# Altium schematic sheet Sheet2.SchDoc
size A4; SheetNumber: 1; SheetTotal: 2; Time: DD
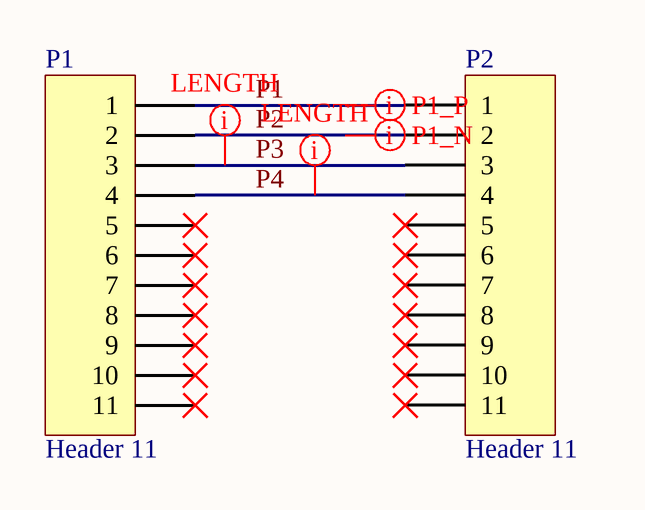
[diagram p0: Sheet2.SchDoc]

## Parts
P1  Header 11  [HDR1X11]
P2  Header 11  [HDR1X11]

## Nets
P1: P1.1 P2.1
P2: P1.2 P2.2
P3: P1.3 P2.3
P4: P1.4 P2.4

Not connected (* = marked no-connect by the designer): P1 5* 6* 7* 8* 9* 10* 11*; P2 5* 6* 7* 8* 9* 10* 11*

## Layout directives
differential pair; differential pair class PAIR: P1
differential pair; net class *; rule Matched Net Lengths [Tolerance = 100mil]; differential pair class PAIR: P2
net class len: P3, P4

## Notes on the sheet
- Title
- For
- Prod No.
- LCS
- Drawn:
- Size:
- A4
- Number:
- Checked:
- Revision:
- Approved:
- CONTROLS PVT LTD
- Partner in Weighing
- THIS DRAWING IS THE PROPERTY OF
- OR COPIED WITHOUT PERMISSION.
- LCS CONTROLS AND  IS NOT TO BE
- and Automation
- Issue No.
- DATE
- RELEASED FOR:
- MANUFACT
- Date:
- Sheet
- of

## Library data of the parts
P1 P2 = Header 11: Header, 11-Pin; LatestRevisionDate: 17-Jul-2002; LatestRevisionNote: Re-released for DXP Platform.; Publisher: Altium Limited